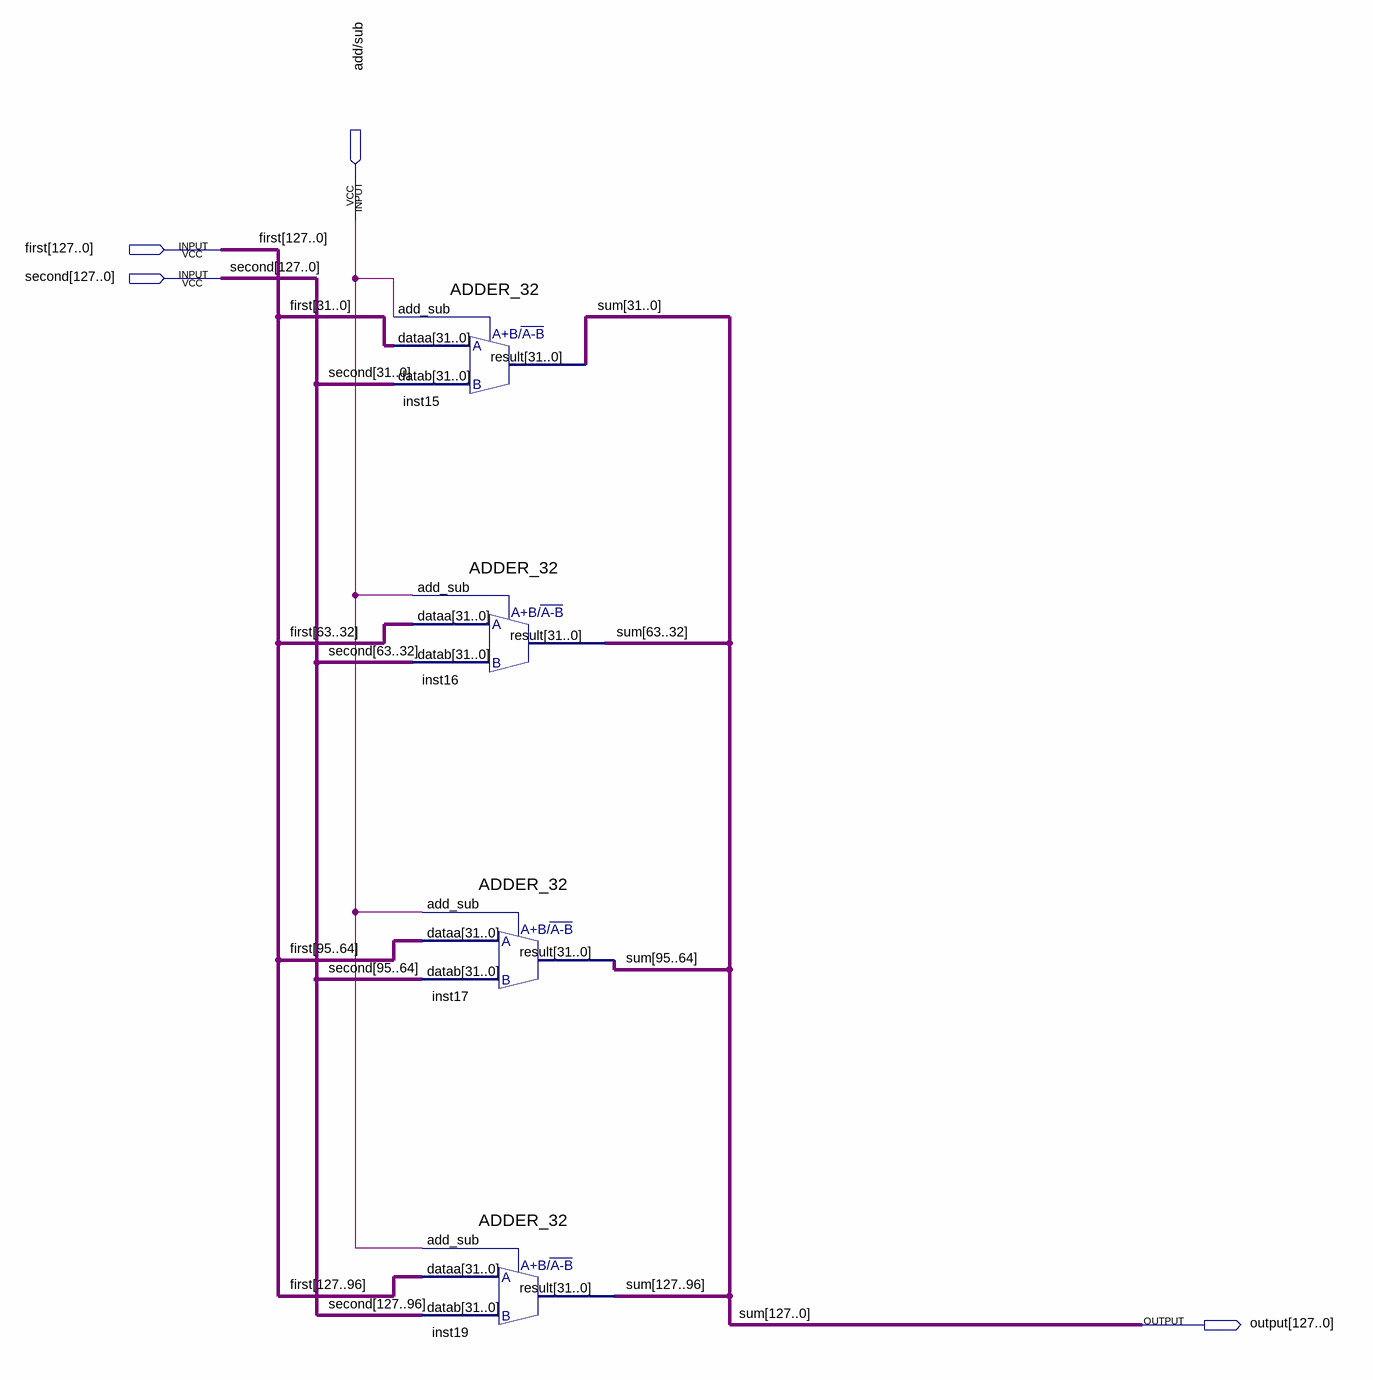
[diagram p0: schematic sheet]
// Quartus schematic AdderPolynomial.bdf as structural Verilog: 4 symbols, 4 pins
module AdderPolynomial (
  input  \add/sub ,
  input  [127:0] first,
  input  [127:0] second,
  output [127:0] \output 
);

  ADDER_32 inst15 (.dataa(first[31:0]), .datab(second[31:0]), .add_sub(\add/sub ), .result(\output [31:0]));
  ADDER_32 inst16 (.dataa(first[63:32]), .datab(second[63:32]), .add_sub(\add/sub ), .result(\output [63:32]));
  ADDER_32 inst17 (.dataa(first[95:64]), .datab(second[95:64]), .add_sub(\add/sub ), .result(\output [95:64]));
  ADDER_32 inst19 (.dataa(first[127:96]), .datab(second[127:96]), .add_sub(\add/sub ), .result(\output [127:96]));

  // Other names for the same wires on the sheet: sum[127:0] = \output 
endmodule
